# Altium schematic sheet DRV8350R Schematic.SchDoc: DRV
size A; SheetNumber: 2; SheetTotal: 3
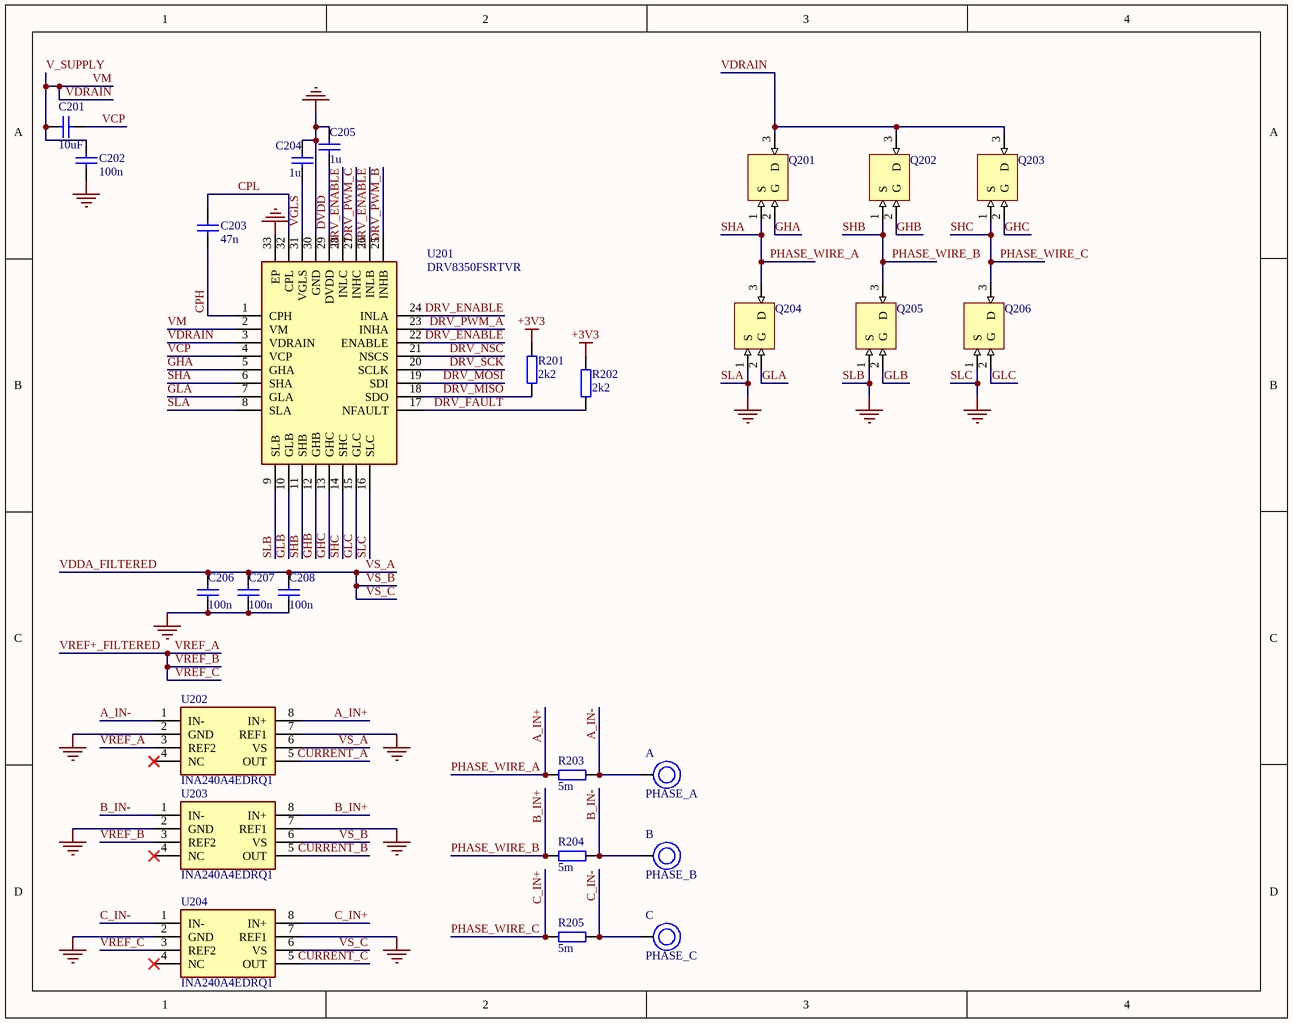
[diagram p0: DRV8350R Schematic.SchDoc]

## Parts
A  PHASE_A  [PAD_HOLE]
B  PHASE_B  [PAD_HOLE]
C  PHASE_C  [PAD_HOLE]
C201  10uF  [CAPC1608X90N]
C202  100n  [CAPC1608X90N]
C203  47n  [CAPC1005X55N]
C204  1u  [CAPC1005X55N]
C205  1u  [CAPC1005X55N]
C206  100n  [CAPC1050X55X23ML05T13]
C207  100n  [CAPC1050X55X23ML05T13]
C208  100n  [CAPC1050X55X23ML05T13]
Q201  NTTFS3D7N06HLTWG  [PQFN-8]  (value not drawn)
Q202  NTTFS3D7N06HLTWG  [PQFN-8]  (value not drawn)
Q203  NTTFS3D7N06HLTWG  [PQFN-8]  (value not drawn)
Q204  NTTFS3D7N06HLTWG  [PQFN-8]  (value not drawn)
Q205  NTTFS3D7N06HLTWG  [PQFN-8]  (value not drawn)
Q206  NTTFS3D7N06HLTWG  [PQFN-8]  (value not drawn)
R201  2k2  [RESC1608X55N]
R202  2k2  [RESC1608X55N]
R203  5m  [RESC3216X80N]
R204  5m  [RESC3216X80N]
R205  5m  [RESC3216X80N]
U201  DRV8350FSRTVR  [WQFN-N32-THM]
U202  INA240A4EDRQ1  [SOIC127P600X175-8N]
U203  INA240A4EDRQ1  [SOIC127P600X175-8N]
U204  INA240A4EDRQ1  [SOIC127P600X175-8N]

## Nets
+3V3: R201.2 R202.2
SLA: C202.1 C204.2 C205.1 C206.1 C207.1 C208.1 Q204.1(S) Q205.1(S) Q206.1(S) U201.8(SLA) U201.9(SLB) U201.16(SLC) U201.30(GND) U201.33(EP) U202.2(GND) U202.7(REF1) U203.2(GND) U203.7(REF1) U204.2(GND) U204.7(REF1)  [also labelled GND, SLB, SLC]
A_IN+: Q201.1(S) Q204.3(D) R203.1 U201.6(SHA) U202.8(IN+)  [also labelled PHASE_WIRE_A, SHA]
A_IN-: A.1 R203.2 U202.1(IN-)
B_IN+: Q202.1(S) Q205.3(D) R204.1 U201.11(SHB) U203.8(IN+)  [also labelled PHASE_WIRE_B, SHB]
B_IN-: B.1 R204.2 U203.1(IN-)
C_IN+: Q203.1(S) Q206.3(D) R205.1 U201.14(SHC) U204.8(IN+)  [also labelled PHASE_WIRE_C, SHC]
C_IN-: C.1 R205.2 U204.1(IN-)
CPH: C203.2 U201.1(CPH)
CPL: C203.1 U201.32(CPL)
CURRENT_A: U202.5(OUT)
CURRENT_B: U203.5(OUT)
CURRENT_C: U204.5(OUT)
DRV_ENABLE: U201.22(ENABLE) U201.24(INLA) U201.26(INLB) U201.28(INLC)
DRV_FAULT: R202.1 U201.17(NFAULT)
DRV_MISO: R201.1 U201.18(SDO)
DRV_MOSI: U201.19(SDI)
DRV_NSC: U201.21(NSCS)
DRV_PWM_A: U201.23(INHA)
DRV_PWM_B: U201.25(INHB)
DRV_PWM_C: U201.27(INHC)
DRV_SCK: U201.20(SCLK)
DVDD: C205.2 U201.29(DVDD)
GHA: Q201.2(G) U201.5(GHA)
GHB: Q202.2(G) U201.12(GHB)
GHC: Q203.2(G) U201.13(GHC)
GLA: Q204.2(G) U201.7(GLA)
GLB: Q205.2(G) U201.10(GLB)
GLC: Q206.2(G) U201.15(GLC)
V_SUPPLY: C201.1 C202.2 Q201.3(D) Q202.3(D) Q203.3(D) U201.2(VM) U201.3(VDRAIN)  [also labelled VDRAIN, VM]
VCP: C201.2 U201.4(VCP)
VDDA_FILTERED: C206.2 C207.2 C208.2 U202.6(VS) U203.6(VS) U204.6(VS)  [also labelled VS_A, VS_B, VS_C]
VGLS: C204.1 U201.31(VGLS)
VREF+_FILTERED: U202.3(REF2) U203.3(REF2) U204.3(REF2)  [also labelled VREF_A, VREF_B, VREF_C]

Not connected (* = marked no-connect by the designer): U202 4(NC)*; U203 4(NC)*; U204 4(NC)*

## Library data of the parts
A B C = 3MM_PAD
C201 = CAP_0805_50V: Capacitor; Manufacturer_Name: Samsung Electro-Mechanics; Manufacturer_Part_Number: CL05B104KO5NNNC; Datasheet Link: https://datasheet.datasheetarchive.com/originals/distributors/Datasheets-DGA10/2408147.pdf; Height: 0.55mm; Mouser Part Number: 187-CL05B104KO5NNNC; Mouser Price/Stock: https://www.mouser.co.uk/ProductDetail/Samsung-Electro-Mechanics/CL05B104KO5NNNC?qs=hqM3L16%252BxlfT2SKOuAUq6Q%3D%3D; Arrow Part Number: CL05B104KO5NNNC; Arrow Price/Stock: https://www.arrow.com/en/products/cl05b104ko5nnnc/samsung-electro-mechanics
C202 = CAP_0603_100V: Capacitor; Manufacturer_Name: Samsung Electro-Mechanics; Manufacturer_Part_Number: CL05B104KO5NNNC; Datasheet Link: https://datasheet.datasheetarchive.com/originals/distributors/Datasheets-DGA10/2408147.pdf; Height: 0.55mm; Mouser Part Number: 187-CL05B104KO5NNNC; Mouser Price/Stock: https://www.mouser.co.uk/ProductDetail/Samsung-Electro-Mechanics/CL05B104KO5NNNC?qs=hqM3L16%252BxlfT2SKOuAUq6Q%3D%3D; Arrow Part Number: CL05B104KO5NNNC; Arrow Price/Stock: https://www.arrow.com/en/products/cl05b104ko5nnnc/samsung-electro-mechanics
C203-C205 = CAP_0402_50V: Capacitor; Manufacturer_Name: Samsung Electro-Mechanics; Manufacturer_Part_Number: CL05B104KO5NNNC; Datasheet Link: https://datasheet.datasheetarchive.com/originals/distributors/Datasheets-DGA10/2408147.pdf; Height: 0.55mm; Mouser Part Number: 187-CL05B104KO5NNNC; Mouser Price/Stock: https://www.mouser.co.uk/ProductDetail/Samsung-Electro-Mechanics/CL05B104KO5NNNC?qs=hqM3L16%252BxlfT2SKOuAUq6Q%3D%3D; Arrow Part Number: CL05B104KO5NNNC; Arrow Price/Stock: https://www.arrow.com/en/products/cl05b104ko5nnnc/samsung-electro-mechanics
C206-C208 = CMP-2000-05439-1: Chip Capacitor, 100 nF, +/- 10%, 16 V, -55 to 125 degC, 0402 (1005 Metric), RoHS, Tape and Reel; Manufacturer: Samsung Electro-Mechanics; Capacitance: 100000pF; Dielectric: X7R; Rated Voltage: 16V; Case Size/Dimension: 0402; Tolerance (%): ±10%; Manufacturer URL: http://www.samsungsem.com/global/index.jsp; Datasheet URL: https://datasheet.ciiva.com/29198/458718-da-01-en-vs-kondensator-0402-29198423.pdf; Datasheet Version: Nov-10
R201 R202 = RES_0603
R203-R205 = RES_1206
U202-U204 = INA240A4EDRQ1: Integrated Circuit; Manufacturer_Name: Texas Instruments; Datasheet Link: http://www.ti.com/lit/ds/symlink/ina240-q1.pdf; Height: 1.75mm; Manufacturer_Part_Number: INA240A4EDRQ1; Mouser Part Number: 595-INA240A4EDRQ1; Mouser Price/Stock: https://www.mouser.co.uk/ProductDetail/Texas-Instruments/INA240A4EDRQ1?qs=yBt6ao%2FxsTymmpZKpOwKvQ%3D%3D; Arrow Part Number: INA240A4EDRQ1; Arrow Price/Stock: https://www.arrow.com/en/products/ina240a4edrq1/texas-instruments